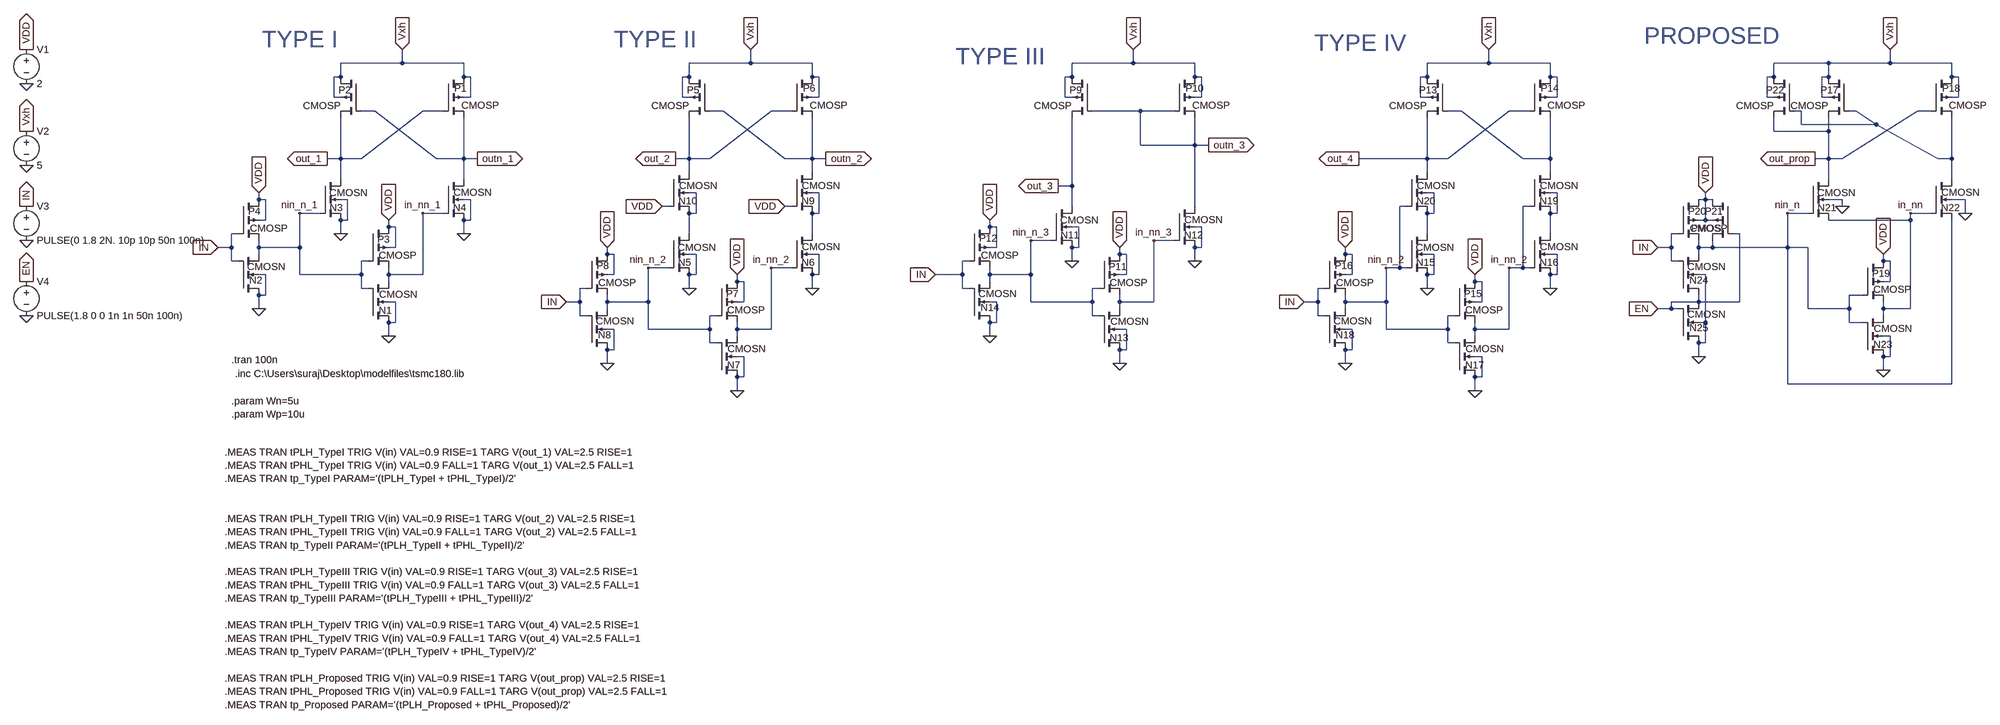
[diagram p0: schematic Level-shifter_01.asc]
Level-shifter_01.asc, the LTspice schematic file:
Version 4
SHEET 1 4772 1096
WIRE -224 -288 -224 -320
WIRE -224 -288 -368 -288
WIRE -80 -288 -224 -288
WIRE 592 -288 592 -320
WIRE 592 -288 448 -288
WIRE 736 -288 592 -288
WIRE 1488 -288 1488 -320
WIRE 1488 -288 1344 -288
WIRE 1632 -288 1488 -288
WIRE 2320 -288 2320 -320
WIRE 2320 -288 2176 -288
WIRE 2464 -288 2320 -288
WIRE 3216 -288 3088 -288
WIRE 3360 -288 3360 -320
WIRE 3360 -288 3216 -288
WIRE 3504 -288 3360 -288
WIRE -368 -256 -368 -288
WIRE -368 -256 -384 -256
WIRE -80 -256 -80 -288
WIRE -64 -256 -80 -256
WIRE 448 -256 448 -288
WIRE 448 -256 432 -256
WIRE 736 -256 736 -288
WIRE 752 -256 736 -256
WIRE 1344 -256 1344 -288
WIRE 1344 -256 1328 -256
WIRE 1632 -256 1632 -288
WIRE 1648 -256 1632 -256
WIRE 2176 -256 2176 -288
WIRE 2176 -256 2160 -256
WIRE 2464 -256 2464 -288
WIRE 2480 -256 2464 -256
WIRE 3088 -256 3088 -288
WIRE 3088 -256 3072 -256
WIRE 3216 -256 3216 -288
WIRE 3216 -256 3200 -256
WIRE 3504 -256 3504 -288
WIRE 3520 -256 3504 -256
WIRE -80 -240 -80 -256
WIRE 736 -240 736 -256
WIRE 1632 -240 1632 -256
WIRE 2464 -240 2464 -256
WIRE 3504 -240 3504 -256
WIRE -384 -208 -384 -256
WIRE -368 -208 -384 -208
WIRE -64 -208 -64 -256
WIRE -64 -208 -80 -208
WIRE 432 -208 432 -256
WIRE 448 -208 432 -208
WIRE 752 -208 752 -256
WIRE 752 -208 736 -208
WIRE 1328 -208 1328 -256
WIRE 1344 -208 1328 -208
WIRE 1648 -208 1648 -256
WIRE 1648 -208 1632 -208
WIRE 2160 -208 2160 -256
WIRE 2176 -208 2160 -208
WIRE 2480 -208 2480 -256
WIRE 2480 -208 2464 -208
WIRE 3072 -208 3072 -256
WIRE 3088 -208 3072 -208
WIRE 3200 -208 3200 -256
WIRE 3216 -208 3200 -208
WIRE 3520 -208 3520 -256
WIRE 3520 -208 3504 -208
WIRE -288 -176 -320 -176
WIRE -128 -176 -176 -176
WIRE 528 -176 496 -176
WIRE 688 -176 640 -176
WIRE 1504 -176 1392 -176
WIRE 1584 -176 1504 -176
WIRE 2256 -176 2224 -176
WIRE 2416 -176 2368 -176
WIRE 3152 -176 3136 -176
WIRE 3280 -176 3264 -176
WIRE 3456 -176 3424 -176
WIRE 3152 -144 3152 -176
WIRE 3328 -144 3280 -176
WIRE 3328 -144 3152 -144
WIRE 3088 -128 3088 -160
WIRE 3216 -128 3216 -160
WIRE 3216 -128 3088 -128
WIRE 1504 -96 1504 -176
WIRE 1632 -96 1632 -160
WIRE 1632 -96 1504 -96
WIRE 1664 -96 1632 -96
WIRE -368 -64 -368 -160
WIRE -368 -64 -400 -64
WIRE -320 -64 -176 -176
WIRE -320 -64 -368 -64
WIRE -144 -64 -288 -176
WIRE -80 -64 -80 -160
WIRE -80 -64 -144 -64
WIRE -48 -64 -80 -64
WIRE 448 -64 448 -160
WIRE 448 -64 416 -64
WIRE 496 -64 640 -176
WIRE 496 -64 448 -64
WIRE 672 -64 528 -176
WIRE 736 -64 736 -160
WIRE 736 -64 672 -64
WIRE 768 -64 736 -64
WIRE 2176 -64 2176 -160
WIRE 2176 -64 2016 -64
WIRE 2224 -64 2368 -176
WIRE 2224 -64 2176 -64
WIRE 2400 -64 2256 -176
WIRE 2464 -64 2464 -160
WIRE 2464 -64 2400 -64
WIRE 3216 -64 3216 -128
WIRE 3216 -64 3184 -64
WIRE 3248 -64 3424 -176
WIRE 3248 -64 3216 -64
WIRE 3472 -64 3328 -144
WIRE 3504 -64 3504 -160
WIRE 3504 -64 3472 -64
WIRE 448 -32 448 -64
WIRE 736 -32 736 -64
WIRE 2176 -32 2176 -64
WIRE 2464 -32 2464 -64
WIRE -368 -16 -368 -64
WIRE -80 -16 -80 -64
WIRE 3216 -16 3216 -64
WIRE 3504 -16 3504 -64
WIRE 1344 0 1344 -160
WIRE 1344 0 1312 0
WIRE 464 16 448 16
WIRE 752 16 736 16
WIRE 2192 16 2176 16
WIRE 2480 16 2464 16
WIRE -560 32 -560 16
WIRE -544 32 -560 32
WIRE -352 32 -368 32
WIRE -64 32 -80 32
WIRE 2928 32 2928 16
WIRE 2928 32 2912 32
WIRE 2944 32 2928 32
WIRE 3248 32 3216 32
WIRE 3536 32 3504 32
WIRE 400 48 384 48
WIRE 688 48 672 48
WIRE 1344 48 1344 0
WIRE 1632 48 1632 -96
WIRE 2128 48 2112 48
WIRE 2416 48 2400 48
WIRE 3248 48 3248 32
WIRE -416 64 -464 64
WIRE -128 64 -176 64
WIRE 464 64 464 16
WIRE 464 64 448 64
WIRE 752 64 752 16
WIRE 752 64 736 64
WIRE 2192 64 2192 16
WIRE 2192 64 2176 64
WIRE 2480 64 2480 16
WIRE 2480 64 2464 64
WIRE 3168 64 3120 64
WIRE 3456 64 3408 64
WIRE 3536 64 3536 32
WIRE -544 80 -544 32
WIRE -544 80 -560 80
WIRE -352 80 -352 32
WIRE -352 80 -368 80
WIRE -64 80 -64 32
WIRE -64 80 -80 80
WIRE 2928 80 2928 32
WIRE 2928 80 2912 80
WIRE 2944 80 2928 80
WIRE 3408 80 3408 64
WIRE 3408 80 3216 80
WIRE -256 96 -256 80
WIRE -240 96 -256 96
WIRE 1152 96 1152 80
WIRE 1168 96 1152 96
WIRE 1360 96 1344 96
WIRE 1648 96 1632 96
WIRE -608 112 -624 112
WIRE -368 112 -368 80
WIRE -80 112 -80 80
WIRE 448 112 448 64
WIRE 736 112 736 64
WIRE 2176 112 2176 64
WIRE 2464 112 2464 64
WIRE 2864 112 2848 112
WIRE 3008 112 2992 112
WIRE 1296 128 1248 128
WIRE 1584 128 1536 128
WIRE -624 144 -624 112
WIRE -624 144 -656 144
WIRE -560 144 -560 128
WIRE -464 144 -464 64
WIRE -464 144 -560 144
WIRE -240 144 -240 96
WIRE -240 144 -256 144
WIRE 1168 144 1168 96
WIRE 1168 144 1152 144
WIRE 1360 144 1360 96
WIRE 1360 144 1344 144
WIRE 1648 144 1648 96
WIRE 1648 144 1632 144
WIRE 2848 144 2848 112
WIRE 2848 144 2816 144
WIRE 2912 144 2912 128
WIRE 2944 144 2944 128
WIRE 2944 144 2912 144
WIRE 3120 144 3120 64
WIRE 3120 144 2944 144
WIRE 3168 144 3120 144
WIRE -560 160 -560 144
WIRE 256 160 256 144
WIRE 272 160 256 160
WIRE 464 160 448 160
WIRE 752 160 736 160
WIRE 1456 160 1456 144
WIRE 1472 160 1456 160
WIRE 1984 160 1984 144
WIRE 2000 160 1984 160
WIRE 2192 160 2176 160
WIRE 2480 160 2464 160
WIRE 2912 160 2912 144
WIRE -624 176 -624 144
WIRE -608 176 -624 176
WIRE -304 176 -320 176
WIRE 1104 176 1088 176
WIRE 1344 176 1344 144
WIRE 1632 176 1632 144
WIRE 2848 176 2848 144
WIRE 2864 176 2848 176
WIRE 3344 176 3344 160
WIRE 3360 176 3344 176
WIRE 400 192 352 192
WIRE 688 192 640 192
WIRE 2112 192 2112 48
WIRE 2112 192 2080 192
WIRE 2128 192 2112 192
WIRE 2400 192 2400 48
WIRE 2400 192 2368 192
WIRE 2416 192 2400 192
WIRE -544 208 -560 208
WIRE -464 208 -464 144
WIRE -320 208 -320 176
WIRE -320 208 -464 208
WIRE -256 208 -256 192
WIRE -176 208 -176 64
WIRE -176 208 -256 208
WIRE 272 208 272 160
WIRE 272 208 256 208
WIRE 464 208 464 160
WIRE 464 208 448 208
WIRE 752 208 752 160
WIRE 752 208 736 208
WIRE 1088 208 1088 176
WIRE 1088 208 1024 208
WIRE 1152 208 1152 192
WIRE 1248 208 1248 128
WIRE 1248 208 1152 208
WIRE 1472 208 1472 160
WIRE 1472 208 1456 208
WIRE 2000 208 2000 160
WIRE 2000 208 1984 208
WIRE 2192 208 2192 160
WIRE 2192 208 2176 208
WIRE 2480 208 2480 160
WIRE 2480 208 2464 208
WIRE 2928 208 2912 208
WIRE -256 224 -256 208
WIRE 560 224 560 208
WIRE 576 224 560 224
WIRE 1152 224 1152 208
WIRE 2288 224 2288 208
WIRE 2304 224 2288 224
WIRE 3360 224 3360 176
WIRE 3360 224 3344 224
WIRE -320 240 -320 208
WIRE -304 240 -320 240
WIRE 208 240 192 240
WIRE 448 240 448 208
WIRE 736 240 736 208
WIRE 1088 240 1088 208
WIRE 1104 240 1088 240
WIRE 1408 240 1392 240
WIRE 1936 240 1920 240
WIRE 2176 240 2176 208
WIRE 2464 240 2464 208
WIRE -544 256 -544 208
WIRE -544 256 -560 256
WIRE 3296 256 3264 256
WIRE -240 272 -256 272
WIRE 192 272 192 240
WIRE 192 272 160 272
WIRE 256 272 256 256
WIRE 352 272 352 192
WIRE 352 272 256 272
WIRE 576 272 576 224
WIRE 576 272 560 272
WIRE 1168 272 1152 272
WIRE 1248 272 1248 208
WIRE 1392 272 1392 240
WIRE 1392 272 1248 272
WIRE 1456 272 1456 256
WIRE 1536 272 1536 128
WIRE 1536 272 1456 272
WIRE 1920 272 1920 240
WIRE 1920 272 1888 272
WIRE 1984 272 1984 256
WIRE 2080 272 2080 192
WIRE 2080 272 1984 272
WIRE 2304 272 2304 224
WIRE 2304 272 2288 272
WIRE 2912 272 2912 256
WIRE 2912 272 2848 272
WIRE 3008 272 3008 112
WIRE 3008 272 2912 272
WIRE -560 288 -560 256
WIRE 256 288 256 272
WIRE 1456 288 1456 272
WIRE 1984 288 1984 272
WIRE 2848 288 2848 272
WIRE 2848 288 2816 288
WIRE 2864 288 2848 288
WIRE 3168 288 3168 144
WIRE 3264 288 3264 256
WIRE 3264 288 3168 288
WIRE 3344 288 3344 272
WIRE 3408 288 3408 80
WIRE 3408 288 3344 288
WIRE 192 304 192 272
WIRE 208 304 192 304
WIRE 512 304 496 304
WIRE 1392 304 1392 272
WIRE 1408 304 1392 304
WIRE 1920 304 1920 272
WIRE 1936 304 1920 304
WIRE 2240 304 2224 304
WIRE 3344 304 3344 288
WIRE -240 320 -240 272
WIRE -240 320 -256 320
WIRE 1168 320 1168 272
WIRE 1168 320 1152 320
WIRE 2928 320 2928 208
WIRE 2928 320 2912 320
WIRE 3264 320 3264 288
WIRE 3296 320 3264 320
WIRE 272 336 256 336
WIRE 352 336 352 272
WIRE 496 336 496 304
WIRE 496 336 352 336
WIRE 560 336 560 320
WIRE 640 336 640 192
WIRE 640 336 560 336
WIRE 1472 336 1456 336
WIRE 2000 336 1984 336
WIRE 2080 336 2080 272
WIRE 2224 336 2224 304
WIRE 2224 336 2080 336
WIRE 2288 336 2288 320
WIRE 2368 336 2368 192
WIRE 2368 336 2288 336
WIRE -256 352 -256 320
WIRE 560 352 560 336
WIRE 1152 352 1152 320
WIRE 2288 352 2288 336
WIRE 3360 352 3344 352
WIRE 496 368 496 336
WIRE 512 368 496 368
WIRE 2224 368 2224 336
WIRE 2240 368 2224 368
WIRE 2928 368 2928 320
WIRE 2928 368 2912 368
WIRE 272 384 272 336
WIRE 272 384 256 384
WIRE 1472 384 1472 336
WIRE 1472 384 1456 384
WIRE 2000 384 2000 336
WIRE 2000 384 1984 384
WIRE 576 400 560 400
WIRE 2304 400 2288 400
WIRE 2912 400 2912 368
WIRE 3360 400 3360 352
WIRE 3360 400 3344 400
WIRE 256 416 256 384
WIRE 1456 416 1456 384
WIRE 1984 416 1984 384
WIRE 3344 432 3344 400
WIRE 576 448 576 400
WIRE 576 448 560 448
WIRE 2304 448 2304 400
WIRE 2304 448 2288 448
WIRE 3120 464 3120 144
WIRE 3504 464 3504 80
WIRE 3504 464 3120 464
WIRE 560 480 560 448
WIRE 2288 480 2288 448
FLAG -368 112 0
FLAG -80 112 0
FLAG -224 -320 Vxh
IOPIN -224 -320 In
FLAG -400 -64 out_1
IOPIN -400 -64 Out
FLAG -256 80 VDD
IOPIN -256 80 In
FLAG -560 16 VDD
IOPIN -560 16 In
FLAG -656 144 IN
IOPIN -656 144 In
FLAG -560 288 0
FLAG -256 352 0
FLAG 448 240 0
FLAG 736 240 0
FLAG 592 -320 Vxh
IOPIN 592 -320 In
FLAG 416 -64 out_2
IOPIN 416 -64 Out
FLAG 560 208 VDD
IOPIN 560 208 In
FLAG 256 144 VDD
IOPIN 256 144 In
FLAG 160 272 IN
IOPIN 160 272 In
FLAG 256 416 0
FLAG 560 480 0
FLAG 640 192 in_nn_2
FLAG -176 64 in_nn_1
FLAG 672 48 VDD
IOPIN 672 48 In
FLAG 384 48 VDD
IOPIN 384 48 In
FLAG 1344 176 0
FLAG 1632 176 0
FLAG 1488 -320 Vxh
IOPIN 1488 -320 In
FLAG 1312 0 out_3
IOPIN 1312 0 Out
FLAG 1456 144 VDD
IOPIN 1456 144 In
FLAG 1152 80 VDD
IOPIN 1152 80 In
FLAG 1024 208 IN
IOPIN 1024 208 In
FLAG 1152 352 0
FLAG 1456 416 0
FLAG 1536 128 in_nn_3
FLAG 1248 128 nin_n_3
FLAG 352 192 nin_n_2
FLAG -464 64 nin_n_1
FLAG -48 -64 outn_1
IOPIN -48 -64 Out
FLAG 768 -64 outn_2
IOPIN 768 -64 Out
FLAG 1664 -96 outn_3
IOPIN 1664 -96 Out
FLAG 3360 -320 Vxh
IOPIN 3360 -320 In
FLAG 3184 -64 out_prop
IOPIN 3184 -64 Out
FLAG 3344 160 VDD
IOPIN 3344 160 In
FLAG 2816 144 IN
IOPIN 2816 144 In
FLAG 2912 400 0
FLAG 3344 432 0
FLAG 3408 64 in_nn
FLAG 3120 64 nin_n
FLAG 2928 16 VDD
IOPIN 2928 16 In
FLAG 2816 288 EN
IOPIN 2816 288 In
FLAG 3248 48 0
FLAG 3536 64 0
FLAG -1104 -48 0
FLAG -1104 -240 0
FLAG -1104 -320 VDD
IOPIN -1104 -320 Out
FLAG -1104 -128 Vxh
IOPIN -1104 -128 Out
FLAG -1104 128 0
FLAG -1104 48 IN
IOPIN -1104 48 Out
FLAG 2176 240 0
FLAG 2464 240 0
FLAG 2320 -320 Vxh
IOPIN 2320 -320 In
FLAG 2016 -64 out_4
IOPIN 2016 -64 Out
FLAG 2288 208 VDD
IOPIN 2288 208 In
FLAG 1984 144 VDD
IOPIN 1984 144 In
FLAG 1888 272 IN
IOPIN 1888 272 In
FLAG 1984 416 0
FLAG 2288 480 0
FLAG 2368 192 in_nn_2
FLAG 2080 192 nin_n_2
FLAG -1104 304 0
FLAG -1104 224 EN
IOPIN -1104 224 Out
SYMBOL nmos4 -416 -16 R0
WINDOW 0 22 67 Left 2
WINDOW 3 21 32 Left 2
SYMATTR InstName N3
SYMATTR Value CMOSN
SYMATTR Value2 l=0.18u w=5u
SYMBOL nmos4 -128 -16 R0
WINDOW 0 23 67 Left 2
WINDOW 3 24 31 Left 2
SYMATTR InstName N4
SYMATTR Value CMOSN
SYMATTR Value2 l=0.18u w=5u
SYMBOL pmos4 -320 -256 M0
WINDOW 0 24 31 Left 2
WINDOW 3 49 68 Left 2
SYMATTR InstName P2
SYMATTR Value CMOSP
SYMATTR Value2 l=0.18u w=0.4u
SYMBOL pmos4 -128 -256 R0
WINDOW 0 26 27 Left 2
WINDOW 3 42 67 Left 2
SYMATTR InstName P1
SYMATTR Value CMOSP
SYMATTR Value2 l=0.18u w=0.4u
SYMBOL nmos4 -304 320 M180
WINDOW 0 25 28 Left 2
WINDOW 3 26 66 Left 2
SYMATTR InstName N1
SYMATTR Value CMOSN
SYMATTR Value2 l=0.18u w=5u
SYMBOL pmos4 -304 96 R0
WINDOW 0 22 29 Left 2
WINDOW 3 25 67 Left 2
SYMATTR InstName P3
SYMATTR Value CMOSP
SYMATTR Value2 l=0.18u w=10u
SYMBOL nmos4 -608 256 M180
WINDOW 0 26 35 Left 2
WINDOW 3 21 67 Left 2
SYMATTR InstName N2
SYMATTR Value CMOSN
SYMATTR Value2 l=0.18u w=5u
SYMBOL pmos4 -608 32 R0
WINDOW 0 23 27 Left 2
WINDOW 3 27 67 Left 2
SYMATTR InstName P4
SYMATTR Value CMOSP
SYMATTR Value2 l=0.18u w=10u
SYMBOL nmos4 400 112 R0
WINDOW 0 22 67 Left 2
WINDOW 3 21 32 Left 2
SYMATTR InstName N5
SYMATTR Value CMOSN
SYMATTR Value2 l=0.18u w=3u
SYMBOL nmos4 688 112 R0
WINDOW 0 23 67 Left 2
WINDOW 3 24 31 Left 2
SYMATTR InstName N6
SYMATTR Value CMOSN
SYMATTR Value2 l=0.18u w=3u
SYMBOL pmos4 496 -256 M0
WINDOW 0 24 31 Left 2
WINDOW 3 49 68 Left 2
SYMATTR InstName P5
SYMATTR Value CMOSP
SYMATTR Value2 l=0.18u w=0.4u
SYMBOL pmos4 688 -256 R0
WINDOW 0 26 27 Left 2
WINDOW 3 42 67 Left 2
SYMATTR InstName P6
SYMATTR Value CMOSP
SYMATTR Value2 l=0.18u w=0.4u
SYMBOL nmos4 512 448 M180
WINDOW 0 25 28 Left 2
WINDOW 3 26 66 Left 2
SYMATTR InstName N7
SYMATTR Value CMOSN
SYMATTR Value2 l=0.18u w=Wn
SYMBOL pmos4 512 224 R0
WINDOW 0 22 29 Left 2
WINDOW 3 25 67 Left 2
SYMATTR InstName P7
SYMATTR Value CMOSP
SYMATTR Value2 l=0.18u w=Wp
SYMBOL nmos4 208 384 M180
WINDOW 0 26 35 Left 2
WINDOW 3 21 67 Left 2
SYMATTR InstName N8
SYMATTR Value CMOSN
SYMATTR Value2 l=0.18u w=Wn
SYMBOL pmos4 208 160 R0
WINDOW 0 23 27 Left 2
WINDOW 3 27 67 Left 2
SYMATTR InstName P8
SYMATTR Value CMOSP
SYMATTR Value2 l=0.18u w=Wp
SYMBOL nmos4 688 -32 R0
WINDOW 0 23 67 Left 2
WINDOW 3 24 31 Left 2
SYMATTR InstName N9
SYMATTR Value CMOSN
SYMATTR Value2 l=0.18u w=4u
SYMBOL nmos4 400 -32 R0
WINDOW 0 23 67 Left 2
WINDOW 3 24 31 Left 2
SYMATTR InstName N10
SYMATTR Value CMOSN
SYMATTR Value2 l=0.18u w=4u
SYMBOL nmos4 1296 48 R0
WINDOW 0 22 67 Left 2
WINDOW 3 21 32 Left 2
SYMATTR InstName N11
SYMATTR Value CMOSN
SYMATTR Value2 l=0.18u w=4u
SYMBOL nmos4 1584 48 R0
WINDOW 0 23 67 Left 2
WINDOW 3 24 31 Left 2
SYMATTR InstName N12
SYMATTR Value CMOSN
SYMATTR Value2 l=0.18u w=4u
SYMBOL pmos4 1392 -256 M0
WINDOW 0 24 31 Left 2
WINDOW 3 49 68 Left 2
SYMATTR InstName P9
SYMATTR Value CMOSP
SYMATTR Value2 l=0.18u w=0.4u
SYMBOL pmos4 1584 -256 R0
WINDOW 0 26 27 Left 2
WINDOW 3 42 67 Left 2
SYMATTR InstName P10
SYMATTR Value CMOSP
SYMATTR Value2 l=0.18u w=0.4u
SYMBOL nmos4 1408 384 M180
WINDOW 0 25 28 Left 2
WINDOW 3 26 66 Left 2
SYMATTR InstName N13
SYMATTR Value CMOSN
SYMATTR Value2 l=0.18u w=Wn
SYMBOL pmos4 1408 160 R0
WINDOW 0 22 29 Left 2
WINDOW 3 25 67 Left 2
SYMATTR InstName P11
SYMATTR Value CMOSP
SYMATTR Value2 l=0.18u w=Wp
SYMBOL nmos4 1104 320 M180
WINDOW 0 26 35 Left 2
WINDOW 3 21 67 Left 2
SYMATTR InstName N14
SYMATTR Value CMOSN
SYMATTR Value2 l=0.18u w=Wn
SYMBOL pmos4 1104 96 R0
WINDOW 0 23 27 Left 2
WINDOW 3 27 67 Left 2
SYMATTR InstName P12
SYMATTR Value CMOSP
SYMATTR Value2 l=0.18u w=Wp
SYMBOL nmos4 3168 -16 R0
WINDOW 0 22 67 Left 2
WINDOW 3 21 32 Left 2
SYMATTR InstName N21
SYMATTR Value CMOSN
SYMATTR Value2 l=0.18u w=2u
SYMBOL nmos4 3456 -16 R0
WINDOW 0 23 67 Left 2
WINDOW 3 24 31 Left 2
SYMATTR InstName N22
SYMATTR Value CMOSN
SYMATTR Value2 l=0.18u w=2u
SYMBOL pmos4 3264 -256 M0
WINDOW 0 24 31 Left 2
WINDOW 3 49 68 Left 2
SYMATTR InstName P17
SYMATTR Value CMOSP
SYMATTR Value2 l=0.18u w=0.2u
SYMBOL pmos4 3456 -256 R0
WINDOW 0 26 27 Left 2
WINDOW 3 42 67 Left 2
SYMATTR InstName P18
SYMATTR Value CMOSP
SYMATTR Value2 l=0.18u w=0.2u
SYMBOL nmos4 3296 400 M180
WINDOW 0 25 28 Left 2
WINDOW 3 26 66 Left 2
SYMATTR InstName N23
SYMATTR Value CMOSN
SYMATTR Value2 l=0.18u w=1u
SYMBOL pmos4 3296 176 R0
WINDOW 0 22 29 Left 2
WINDOW 3 25 67 Left 2
SYMATTR InstName P19
SYMATTR Value CMOSP
SYMATTR Value2 l=0.18u w=2u
SYMBOL nmos4 2864 256 M180
WINDOW 0 26 35 Left 2
WINDOW 3 21 67 Left 2
SYMATTR InstName N24
SYMATTR Value CMOSN
SYMATTR Value2 l=0.18u w=2u
SYMBOL pmos4 2864 32 R0
WINDOW 0 23 27 Left 2
WINDOW 3 27 67 Left 2
SYMATTR InstName P20
SYMATTR Value CMOSP
SYMATTR Value2 l=0.18u w=0.2u
SYMBOL nmos4 2864 368 M180
WINDOW 0 26 35 Left 2
WINDOW 3 21 67 Left 2
SYMATTR InstName N25
SYMATTR Value CMOSN
SYMATTR Value2 l=0.18u w=3u
SYMBOL pmos4 2992 32 M0
WINDOW 0 23 27 Left 2
WINDOW 3 27 67 Left 2
SYMATTR InstName P21
SYMATTR Value2 l=0.18u w=0.2u
SYMBOL pmos4 3136 -256 M0
WINDOW 0 24 31 Left 2
WINDOW 3 49 68 Left 2
SYMATTR InstName P22
SYMATTR Value CMOSP
SYMATTR Value2 l=0.18u w=0.2u
SYMBOL voltage -1104 -336 R0
WINDOW 123 0 0 Left 0
WINDOW 39 0 0 Left 0
SYMATTR InstName V1
SYMATTR Value 2
SYMBOL voltage -1104 -144 R0
WINDOW 123 0 0 Left 0
WINDOW 39 0 0 Left 0
SYMATTR InstName V2
SYMATTR Value 5
SYMBOL voltage -1104 32 R0
WINDOW 123 0 0 Left 0
WINDOW 39 0 0 Left 0
SYMATTR InstName V3
SYMATTR Value PULSE(0 1.8 2N. 10p 10p 50n 100n)
SYMBOL nmos4 2128 112 R0
WINDOW 0 22 67 Left 2
WINDOW 3 21 32 Left 2
SYMATTR InstName N15
SYMATTR Value CMOSN
SYMATTR Value2 l=0.18u w=3u
SYMBOL nmos4 2416 112 R0
WINDOW 0 23 67 Left 2
WINDOW 3 24 31 Left 2
SYMATTR InstName N16
SYMATTR Value CMOSN
SYMATTR Value2 l=0.18u w=3u
SYMBOL pmos4 2224 -256 M0
WINDOW 0 24 31 Left 2
WINDOW 3 49 68 Left 2
SYMATTR InstName P13
SYMATTR Value CMOSP
SYMATTR Value2 l=0.18u w=0.4u
SYMBOL pmos4 2416 -256 R0
WINDOW 0 26 27 Left 2
WINDOW 3 42 67 Left 2
SYMATTR InstName P14
SYMATTR Value CMOSP
SYMATTR Value2 l=5u w=0.4u
SYMBOL nmos4 2240 448 M180
WINDOW 0 25 28 Left 2
WINDOW 3 26 66 Left 2
SYMATTR InstName N17
SYMATTR Value CMOSN
SYMATTR Value2 l=0.18u w=2u
SYMBOL pmos4 2240 224 R0
WINDOW 0 22 29 Left 2
WINDOW 3 25 67 Left 2
SYMATTR InstName P15
SYMATTR Value CMOSP
SYMATTR Value2 l=0.18u w=4u
SYMBOL nmos4 1936 384 M180
WINDOW 0 26 35 Left 2
WINDOW 3 21 67 Left 2
SYMATTR InstName N18
SYMATTR Value CMOSN
SYMATTR Value2 l=0.18u w=2u
SYMBOL pmos4 1936 160 R0
WINDOW 0 23 27 Left 2
WINDOW 3 27 67 Left 2
SYMATTR InstName P16
SYMATTR Value CMOSP
SYMATTR Value2 l=0.18u w=4u
SYMBOL nmos4 2416 -32 R0
WINDOW 0 23 67 Left 2
WINDOW 3 24 31 Left 2
SYMATTR InstName N19
SYMATTR Value CMOSN
SYMATTR Value2 l=0.18u w=4u
SYMBOL nmos4 2128 -32 R0
WINDOW 0 23 67 Left 2
WINDOW 3 24 31 Left 2
SYMATTR InstName N20
SYMATTR Value CMOSN
SYMATTR Value2 l=0.18u w=4u
SYMBOL voltage -1104 208 R0
WINDOW 123 0 0 Left 0
WINDOW 39 0 0 Left 0
SYMATTR InstName V4
SYMATTR Value PULSE(1.8 0 0 1n 1n 50n 100n)
TEXT -552 -344 Left 5 ;TYPE I
TEXT 272 -344 Left 5 ;TYPE II
TEXT 1072 -304 Left 5 ;TYPE III
TEXT 1912 -336 Left 5 ;TYPE IV
TEXT 2784 -352 Left 5 ;PROPOSED
TEXT -624 408 Left 2 !.tran 100n
TEXT -616 440 Left 2 !.inc C:\\Users\\suraj\\Desktop\\modelfiles\\tsmc180.lib
TEXT -624 504 Left 2 !.param Wn=5u\n.param Wp=10u
TEXT -640 624 Left 2 !.MEAS TRAN tPLH_TypeI TRIG V(in) VAL=0.9 RISE=1 TARG V(out_1) VAL=2.5 RISE=1\n.MEAS TRAN tPHL_TypeI TRIG V(in) VAL=0.9 FALL=1 TARG V(out_1) VAL=2.5 FALL=1\n.MEAS TRAN tp_TypeI PARAM='(tPLH_TypeI + tPHL_TypeI)/2'\n \n \n.MEAS TRAN tPLH_TypeII TRIG V(in) VAL=0.9 RISE=1 TARG V(out_2) VAL=2.5 RISE=1\n.MEAS TRAN tPHL_TypeII TRIG V(in) VAL=0.9 FALL=1 TARG V(out_2) VAL=2.5 FALL=1\n.MEAS TRAN tp_TypeII PARAM='(tPLH_TypeII + tPHL_TypeII)/2'\n \n.MEAS TRAN tPLH_TypeIII TRIG V(in) VAL=0.9 RISE=1 TARG V(out_3) VAL=2.5 RISE=1\n.MEAS TRAN tPHL_TypeIII TRIG V(in) VAL=0.9 FALL=1 TARG V(out_3) VAL=2.5 FALL=1\n.MEAS TRAN tp_TypeIII PARAM='(tPLH_TypeIII + tPHL_TypeIII)/2'\n \n.MEAS TRAN tPLH_TypeIV TRIG V(in) VAL=0.9 RISE=1 TARG V(out_4) VAL=2.5 RISE=1\n.MEAS TRAN tPHL_TypeIV TRIG V(in) VAL=0.9 FALL=1 TARG V(out_4) VAL=2.5 FALL=1\n.MEAS TRAN tp_TypeIV PARAM='(tPLH_TypeIV + tPHL_TypeIV)/2'\n \n.MEAS TRAN tPLH_Proposed TRIG V(in) VAL=0.9 RISE=1 TARG V(out_prop) VAL=2.5 RISE=1\n.MEAS TRAN tPHL_Proposed TRIG V(in) VAL=0.9 FALL=1 TARG V(out_prop) VAL=2.5 FALL=1\n.MEAS TRAN tp_Proposed PARAM='(tPLH_Proposed + tPHL_Proposed)/2'

The netlist it stands for:
* Level-shifter_01.asc
M§N3 out_1 nin_n_1 0 0 CMOSN l=0.18u w=5u
M§N4 outn_1 in_nn_1 0 0 CMOSN l=0.18u w=5u
M§P2 Vxh outn_1 out_1 Vxh CMOSP l=0.18u w=0.4u
M§P1 Vxh out_1 outn_1 Vxh CMOSP l=0.18u w=0.4u
M§N1 0 nin_n_1 in_nn_1 0 CMOSN l=0.18u w=5u
M§P3 VDD nin_n_1 in_nn_1 VDD CMOSP l=0.18u w=10u
M§N2 0 IN nin_n_1 0 CMOSN l=0.18u w=5u
M§P4 VDD IN nin_n_1 VDD CMOSP l=0.18u w=10u
M§N5 N003 nin_n_2 0 0 CMOSN l=0.18u w=3u
M§N6 N004 in_nn_2 0 0 CMOSN l=0.18u w=3u
M§P5 Vxh outn_2 out_2 Vxh CMOSP l=0.18u w=0.4u
M§P6 Vxh out_2 outn_2 Vxh CMOSP l=0.18u w=0.4u
M§N7 0 nin_n_2 in_nn_2 0 CMOSN l=0.18u w=Wn
M§P7 VDD nin_n_2 in_nn_2 VDD CMOSP l=0.18u w=Wp
M§N8 0 IN nin_n_2 0 CMOSN l=0.18u w=Wn
M§P8 VDD IN nin_n_2 VDD CMOSP l=0.18u w=Wp
M§N9 outn_2 VDD N004 N004 CMOSN l=0.18u w=4u
M§N10 out_2 VDD N003 N003 CMOSN l=0.18u w=4u
M§N11 out_3 nin_n_3 0 0 CMOSN l=0.18u w=4u
M§N12 outn_3 in_nn_3 0 0 CMOSN l=0.18u w=4u
M§P9 Vxh outn_3 out_3 Vxh CMOSP l=0.18u w=0.4u
M§P10 Vxh outn_3 outn_3 Vxh CMOSP l=0.18u w=0.4u
M§N13 0 nin_n_3 in_nn_3 0 CMOSN l=0.18u w=Wn
M§P11 VDD nin_n_3 in_nn_3 VDD CMOSP l=0.18u w=Wp
M§N14 0 IN nin_n_3 0 CMOSN l=0.18u w=Wn
M§P12 VDD IN nin_n_3 VDD CMOSP l=0.18u w=Wp
M§N21 out_prop nin_n in_nn 0 CMOSN l=0.18u w=2u
M§N22 N002 in_nn nin_n 0 CMOSN l=0.18u w=2u
M§P17 Vxh N002 out_prop Vxh CMOSP l=0.18u w=0.2u
M§P18 Vxh out_prop N002 Vxh CMOSP l=0.18u w=0.2u
M§N23 0 nin_n in_nn 0 CMOSN l=0.18u w=1u
M§P19 VDD nin_n in_nn VDD CMOSP l=0.18u w=2u
M§N24 EN IN nin_n 0 CMOSN l=0.18u w=2u
M§P20 VDD IN nin_n VDD CMOSP l=0.18u w=0.2u
M§N25 0 EN EN 0 CMOSN l=0.18u w=3u
M§P21 VDD EN nin_n VDD PMOS l=0.18u w=0.2u
M§P22 Vxh N002 out_prop Vxh CMOSP l=0.18u w=0.2u
V1 VDD 0 2
V2 Vxh 0 5
V3 IN 0 PULSE(0 1.8 2N. 10p 10p 50n 100n)
M§N15 N005 nin_n_2 0 0 CMOSN l=0.18u w=3u
M§N16 N006 in_nn_2 0 0 CMOSN l=0.18u w=3u
M§P13 Vxh N001 out_4 Vxh CMOSP l=0.18u w=0.4u
M§P14 Vxh out_4 N001 Vxh CMOSP l=5u w=0.4u
M§N17 0 nin_n_2 in_nn_2 0 CMOSN l=0.18u w=2u
M§P15 VDD nin_n_2 in_nn_2 VDD CMOSP l=0.18u w=4u
M§N18 0 IN nin_n_2 0 CMOSN l=0.18u w=2u
M§P16 VDD IN nin_n_2 VDD CMOSP l=0.18u w=4u
M§N19 N001 in_nn_2 N006 N006 CMOSN l=0.18u w=4u
M§N20 out_4 nin_n_2 N005 N005 CMOSN l=0.18u w=4u
V4 EN 0 PULSE(1.8 0 0 1n 1n 50n 100n)
.model NMOS NMOS
.model PMOS PMOS
.lib standard.mos
* TYPE I
* TYPE II
* TYPE III
* TYPE IV
* PROPOSED
.tran 100n
.inc C:\Users\suraj\Desktop\modelfiles\tsmc180.lib
.param Wn=5u
.param Wp=10u
.MEAS TRAN tPLH_TypeI TRIG V(in) VAL=0.9 RISE=1 TARG V(out_1) VAL=2.5 RISE=1
.MEAS TRAN tPHL_TypeI TRIG V(in) VAL=0.9 FALL=1 TARG V(out_1) VAL=2.5 FALL=1
.MEAS TRAN tp_TypeI PARAM='(tPLH_TypeI + tPHL_TypeI)/2'
.MEAS TRAN tPLH_TypeII TRIG V(in) VAL=0.9 RISE=1 TARG V(out_2) VAL=2.5 RISE=1
.MEAS TRAN tPHL_TypeII TRIG V(in) VAL=0.9 FALL=1 TARG V(out_2) VAL=2.5 FALL=1
.MEAS TRAN tp_TypeII PARAM='(tPLH_TypeII + tPHL_TypeII)/2'
.MEAS TRAN tPLH_TypeIII TRIG V(in) VAL=0.9 RISE=1 TARG V(out_3) VAL=2.5 RISE=1
.MEAS TRAN tPHL_TypeIII TRIG V(in) VAL=0.9 FALL=1 TARG V(out_3) VAL=2.5 FALL=1
.MEAS TRAN tp_TypeIII PARAM='(tPLH_TypeIII + tPHL_TypeIII)/2'
.MEAS TRAN tPLH_TypeIV TRIG V(in) VAL=0.9 RISE=1 TARG V(out_4) VAL=2.5 RISE=1
.MEAS TRAN tPHL_TypeIV TRIG V(in) VAL=0.9 FALL=1 TARG V(out_4) VAL=2.5 FALL=1
.MEAS TRAN tp_TypeIV PARAM='(tPLH_TypeIV + tPHL_TypeIV)/2'
.MEAS TRAN tPLH_Proposed TRIG V(in) VAL=0.9 RISE=1 TARG V(out_prop) VAL=2.5 RISE=1
.MEAS TRAN tPHL_Proposed TRIG V(in) VAL=0.9 FALL=1 TARG V(out_prop) VAL=2.5 FALL=1
.MEAS TRAN tp_Proposed PARAM='(tPLH_Proposed + tPHL_Proposed)/2'
.backanno
.end